# EasyEDA schematic SCH_AOG Test Board_2023-11-28.json
TITLE: Sheet_1; REV: 1.0; Date: 2023-11-17; Sheet: 1/1; Company: Your Company
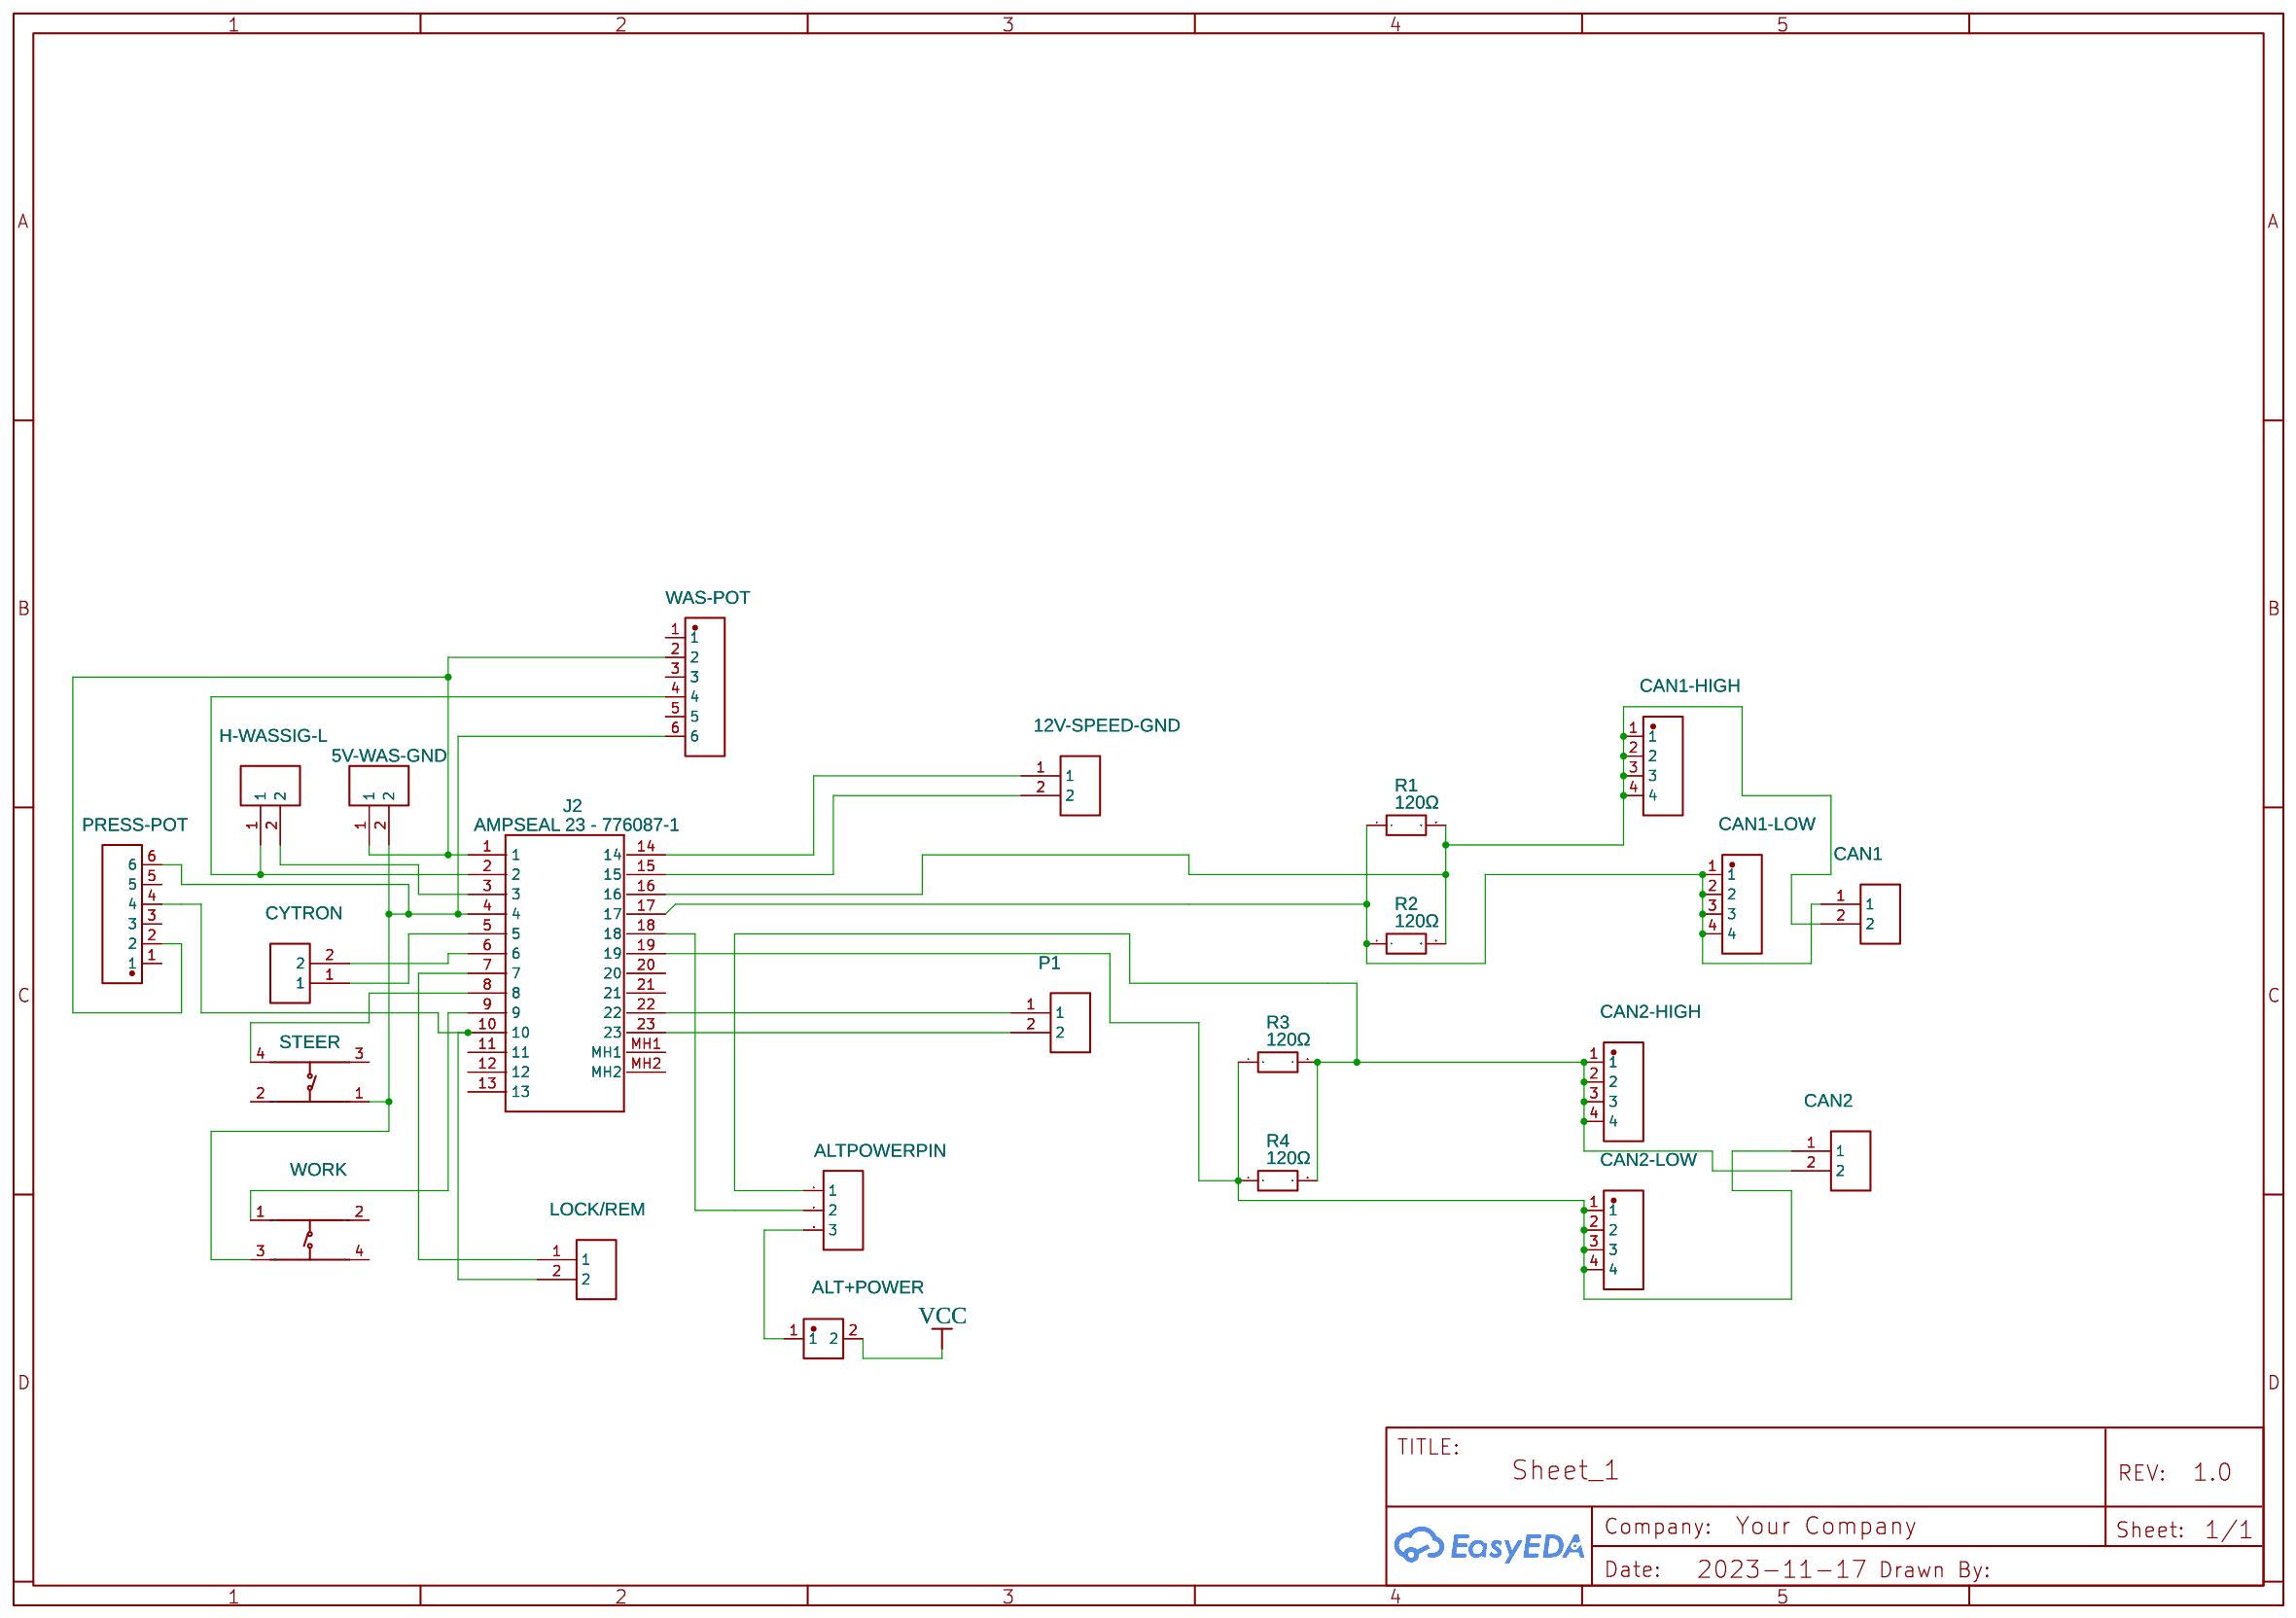
[diagram p0: schematic sheet]

## Parts
5V-WAS-GND  WJ500V-5.08-2P-14-00A  [CONN-TH_2P-P5.00_WJ500V-5.08-2P]
12V-SPEED-GND  WJ500V-5.08-2P-14-00A  [CONN-TH_2P-P5.00_WJ500V-5.08-2P]
ALT+POWER  EST026  [CONN-TH_L6.3-W0.8-EST026]
ALTPOWERPIN  Header-Male-2.54_1x3  [HDR-TH_3P-P2.54-V-M-1]
CAN1  WJ500V-5.08-2P-14-00A  [CONN-TH_2P-P5.00_WJ500V-5.08-2P]
CAN1-HIGH  BX-PZ2.54-1-4PZZ  [HDR-TH_4P-P2.54-V-M]
CAN1-LOW  BX-PZ2.54-1-4PZZ  [HDR-TH_4P-P2.54-V-M]
CAN2  WJ500V-5.08-2P-14-00A  [CONN-TH_2P-P5.00_WJ500V-5.08-2P]
CAN2-HIGH  BX-PZ2.54-1-4PZZ  [HDR-TH_4P-P2.54-V-M]
CAN2-LOW  BX-PZ2.54-1-4PZZ  [HDR-TH_4P-P2.54-V-M]
CYTRON  WJ500V-5.08-2P-14-00A  [CONN-TH_2P-P5.00_WJ500V-5.08-2P]
H-WASSIG-L  WJ500V-5.08-2P-14-00A  [CONN-TH_2P-P5.00_WJ500V-5.08-2P]
J2  AMPSEAL 23 - 776087-1  [7760871]
LOCK/REM  WJ500V-5.08-2P-14-00A  [CONN-TH_2P-P5.00_WJ500V-5.08-2P]
P1  WJ500V-5.08-2P-14-00A  [CONN-TH_2P-P5.00_WJ500V-5.08-2P]
PRESS-POT  Header-Female-2.54_1x6  [HDR-TH_6P-P2.54-V-F]
R1  120Ω  [RES-TH_BD2.4-L6.3-P10.30-D0.6]
R2  120Ω  [RES-TH_BD2.4-L6.3-P10.30-D0.6]
R3  120Ω  [RES-TH_BD2.4-L6.3-P10.30-D0.6]
R4  120Ω  [RES-TH_BD2.4-L6.3-P10.30-D0.6]
STEER  TS665CJ  [SW-TH_4P-L6.0-W6.0-P4.50-LS6.5]
WAS-POT  Header-Female-2.54_1x6  [HDR-TH_6P-P2.54-V-F]
WORK  TS665CJ  [SW-TH_4P-L6.0-W6.0-P4.50-LS6.5]

## Library data of the parts
5V-WAS-GND 12V-SPEED-GND CAN1 CAN2 CYTRON H-WASSIG-L LOCK/REM P1 = WJ500V-5.08-2P-14-00A: Supplier: LCSC; Manufacturer: KANGNEX(康奈克斯电气); Manufacturer Part: WJ500V-5.08-2P; Supplier Part: C8465; JLCPCB Part Class: Extended Part; link: https://lcsc.com/eda_search?q=C8465&%26type=1&ref=editor
ALT+POWER = EST026: Contributor: LCSC; Supplier: LCSC; Supplier Part: C52878; Manufacturer: xcfuse(旭程); JLCPCB Part Class: Extended Part; link: https://lcsc.com/eda_search?q=C52878&%26type=1&ref=editor
ALTPOWERPIN = Header-Male-2.54_1x3: Supplier: LCSC; Manufacturer: BOOMELE(博穆精密); Manufacturer Part: 2.54-1*3P针; Supplier Part: C49257; JLCPCB Part Class: Extended Part; link: https://lcsc.com/eda_search?q=C49257&%26type=1&ref=editor; Contributor: lcsc; 3DModel: HDR-M-2.54_1x3
CAN1-HIGH CAN1-LOW CAN2-HIGH CAN2-LOW = BX-PZ2.54-1-4PZZ: Supplier: LCSC; Supplier Part: C18078201; Manufacturer: Bossie(博锡); Contributor: lcsc; link: https://lcsc.com/eda_search?q=C18078201&%26type=1&ref=editor
J2 = AMPSEAL 23 - 776087-1: Contributor: aKKoufen; Link: https://fr.rs-online.com/web/p/embases-circuits-imprimes/7181471; Code RS: 718-1471; Ref Fabricant: 776087-1; Marque: TE Connectivity; Supplier Part: C378893
PRESS-POT WAS-POT = Header-Female-2.54_1x6: Supplier: LCSC; Manufacturer: BOOMELE(博穆精密); Manufacturer Part: 2.54-1*6P母; Supplier Part: C40877; JLCPCB Part Class: Extended Part; link: https://lcsc.com/eda_search?q=C40877&%26type=1&ref=editor
R1-R4 = RD 1/4W 120R J T/B A1: Contributor: LCSC; Supplier: LCSC; Supplier Part: C433771; Manufacturer: Tyohm(幸亚电阻); JLCPCB Part Class: Extended Part; link: https://lcsc.com/eda_search?q=C433771&%26type=1&ref=editor
STEER WORK = TS665CJ: Contributor: LCSC; Supplier: LCSC; Supplier Part: C393938; Manufacturer: SHOU HAN(首韩); JLCPCB Part Class: Extended Part; link: https://lcsc.com/eda_search?q=C393938&%26type=1&ref=editor

## Nets
VCC: ALT+POWER.2
Net-(5V-WAS-GND-1): 5V-WAS-GND.1 J2.1 PRESS-POT.2 WAS-POT.2
Net-(5V-WAS-GND-2): 5V-WAS-GND.2 J2.4 PRESS-POT.6 STEER.1(A) WAS-POT.6 WORK.3(C)
Net-(12V-SPEED-GND-1): 12V-SPEED-GND.1 J2.14
Net-(12V-SPEED-GND-2): 12V-SPEED-GND.2 J2.15
Net-(ALT+POWER-1): ALT+POWER.1 ALTPOWERPIN.3
Net-(ALTPOWERPIN-1): ALTPOWERPIN.1 CAN2.2 CAN2-HIGH.1 CAN2-HIGH.2 CAN2-HIGH.3 CAN2-HIGH.4 R3.2 R4.2
Net-(ALTPOWERPIN-2): ALTPOWERPIN.2 J2.18
Net-(CAN1-1): CAN1.1 CAN1-LOW.1 CAN1-LOW.2 CAN1-LOW.3 CAN1-LOW.4 J2.17 R1.1 R2.1
Net-(CAN1-2): CAN1.2 CAN1-HIGH.1 CAN1-HIGH.2 CAN1-HIGH.3 CAN1-HIGH.4 J2.16 R1.2 R2.2
Net-(CAN2-1): CAN2.1 CAN2-LOW.1 CAN2-LOW.2 CAN2-LOW.3 CAN2-LOW.4 J2.19 R3.1 R4.1
Net-(CYTRON-1): CYTRON.1 J2.5
Net-(CYTRON-2): CYTRON.2 J2.6
Net-(H-WASSIG-L-1): H-WASSIG-L.1 J2.2 WAS-POT.4
Net-(H-WASSIG-L-2): H-WASSIG-L.2 J2.3
Net-(J2-7): J2.7 LOCK/REM.1
Net-(J2-8): J2.8 STEER.4(D)
Net-(J2-9): J2.9 WORK.1(A)
Net-(J2-10): J2.10 LOCK/REM.2 PRESS-POT.4
Net-(J2-22): J2.22 P1.1
Net-(J2-23): J2.23 P1.2

Not connected (* = marked no-connect by the designer): J2 11 12 13 20 21 MH1 MH2; PRESS-POT 1 3 5; STEER 2(B) 3(C); WAS-POT 1 3 5; WORK 2(B) 4(D)
